# Altium schematic sheet CAN.SchDoc
size A4
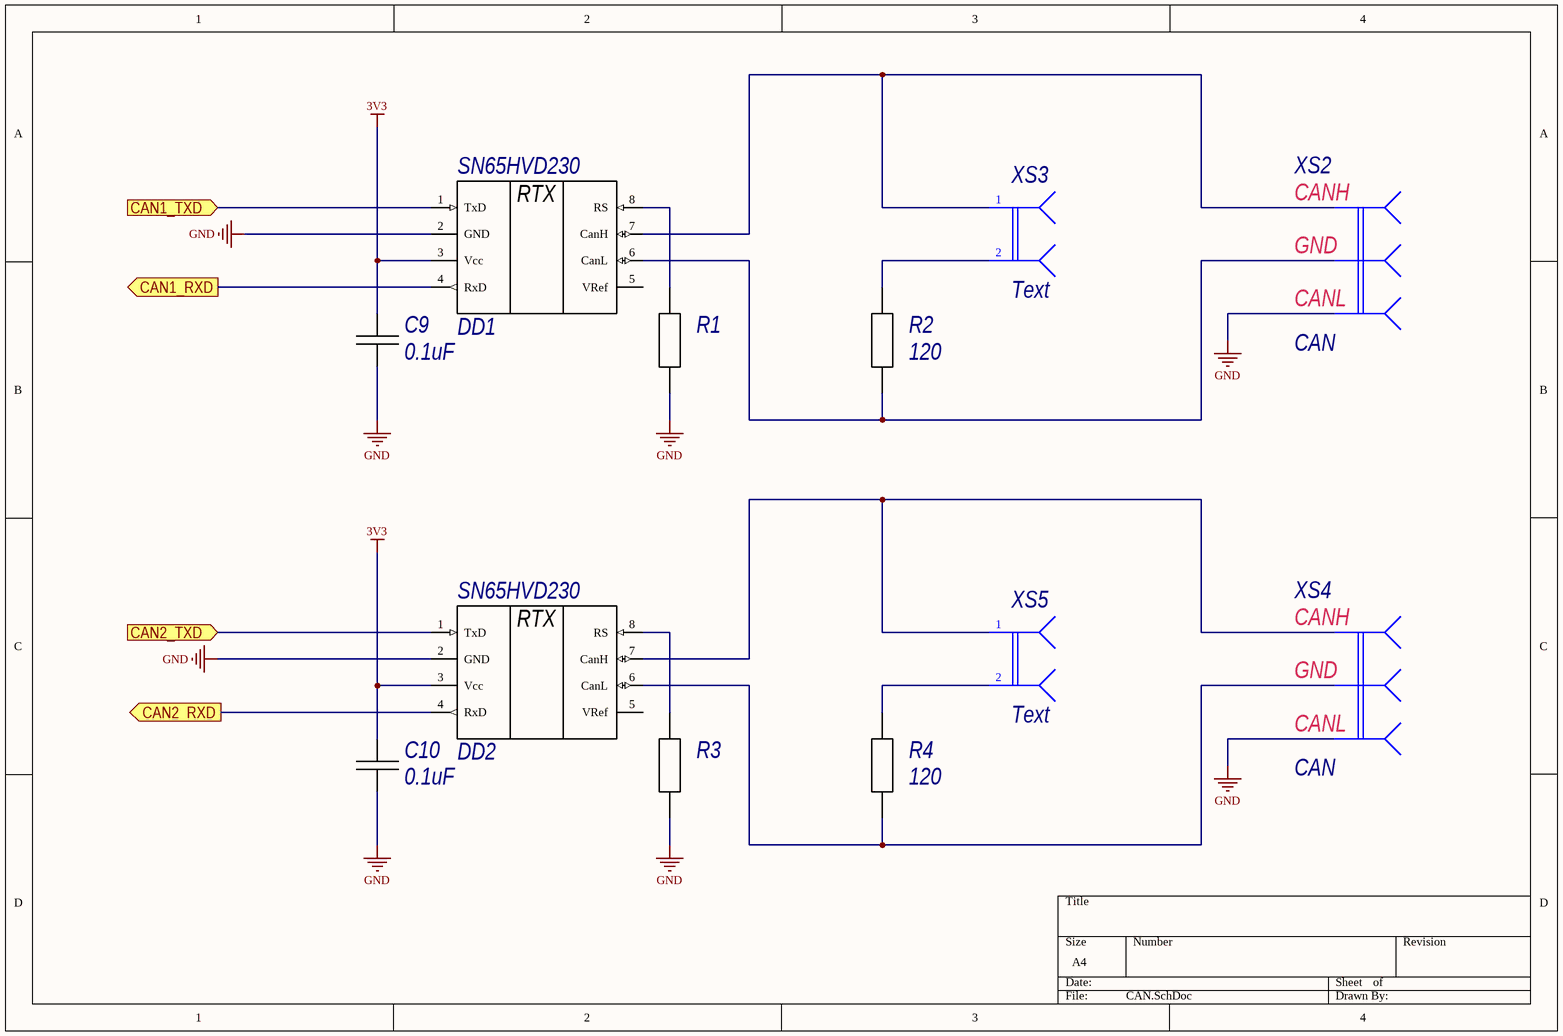
[diagram p0: CAN.SchDoc]

## Parts
C9  0.1uF  [C0805C]
C10  0.1uF  [C0805C]
DD1  SN65HVD230  [SOIC8 (SO-8)]
DD2  SN65HVD230  [SOIC8 (SO-8)]
R1  R0805  [C0805R]  (value not drawn)
R2  120  [C0805R]
R3  R0805  [C0805R]  (value not drawn)
R4  120  [C0805R]
XS2  CAN  [YX-XH-3]
XS3  Text  [PLD2]
XS4  CAN  [YX-XH-3]
XS5  Text  [PLD2]

## Ports
CAN1_RXD (out), CAN1_TXD (in), CAN2_RXD (out), CAN2_TXD (in)

## Nets
3V3: C9.2 C10.2 DD1.3(Vcc) DD2.3(Vcc)
GND: C9.1 C10.1 DD1.2(GND) DD2.2(GND) R1.2 R3.2 XS2.3 XS4.3
CAN1_RXD: DD1.4(RxD) ; port CAN1_RXD
CAN1_TXD: DD1.1(TxD) ; port CAN1_TXD
CAN2_RXD: DD2.4(RxD) ; port CAN2_RXD
CAN2_TXD: DD2.1(TxD) ; port CAN2_TXD
NetDD1_6: DD1.6(CanL) R2.2 XS2.2
NetDD1_7: DD1.7(CanH) XS2.1 XS3.1
NetDD1_8: DD1.8(RS) R1.1
NetDD2_6: DD2.6(CanL) R4.2 XS4.2
NetDD2_7: DD2.7(CanH) XS4.1 XS5.1
NetDD2_8: DD2.8(RS) R3.1
NetR2_1: R2.1 XS3.2
NetR4_1: R4.1 XS5.2

Not connected (* = marked no-connect by the designer): DD1 5(VRef); DD2 5(VRef)

## Notes on the sheet
- (in symbol CONNECT_CAN) CANH; GND; CANL
- (in symbol SN65HVD230) RTX

## Library data of the parts
C9 C10 = CAP_0805: Type: Конденсатор; Published: 18.05.2010; Publisher: Andrew Danich
DD1 DD2 = SN65HVD230: Высокоскоростной CAN-Трансивер, 1Мб/с, 12В/24В, до 112 узлов; Published: 26.02.2013; Publisher: Andrew Danich; Type: Микросхема
R2 R4 = R0805: Published: 24.03.2010; Publisher: Andrew Danich; Type: Резистор
XS2 XS4 = CONNECT_CAN: Published: 07.03.2013; Publisher: Andrew Danich; Type: Розетка
XS3 XS5 = DS1021: Value: Connector; Published: 07.03.2013; Publisher: Andrew Danich; Type: Розетка
R1 R3 = R0805: Published: 24.03.2010; Publisher: Andrew Danich; Type: Резистор